# EAGLE design Kicker (EAGLE 6.4)
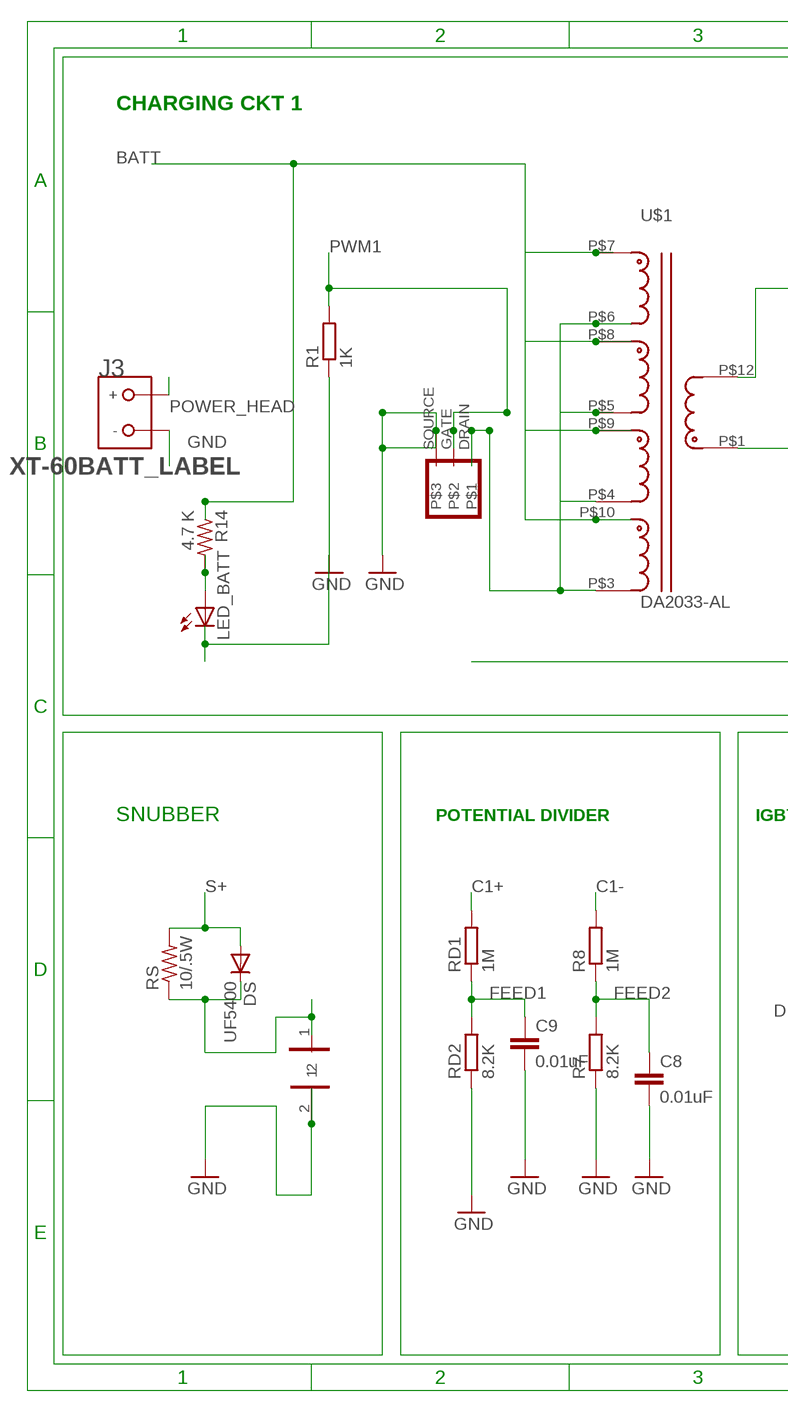
[diagram p0: schematic, sheet 1, part 1 of 2]
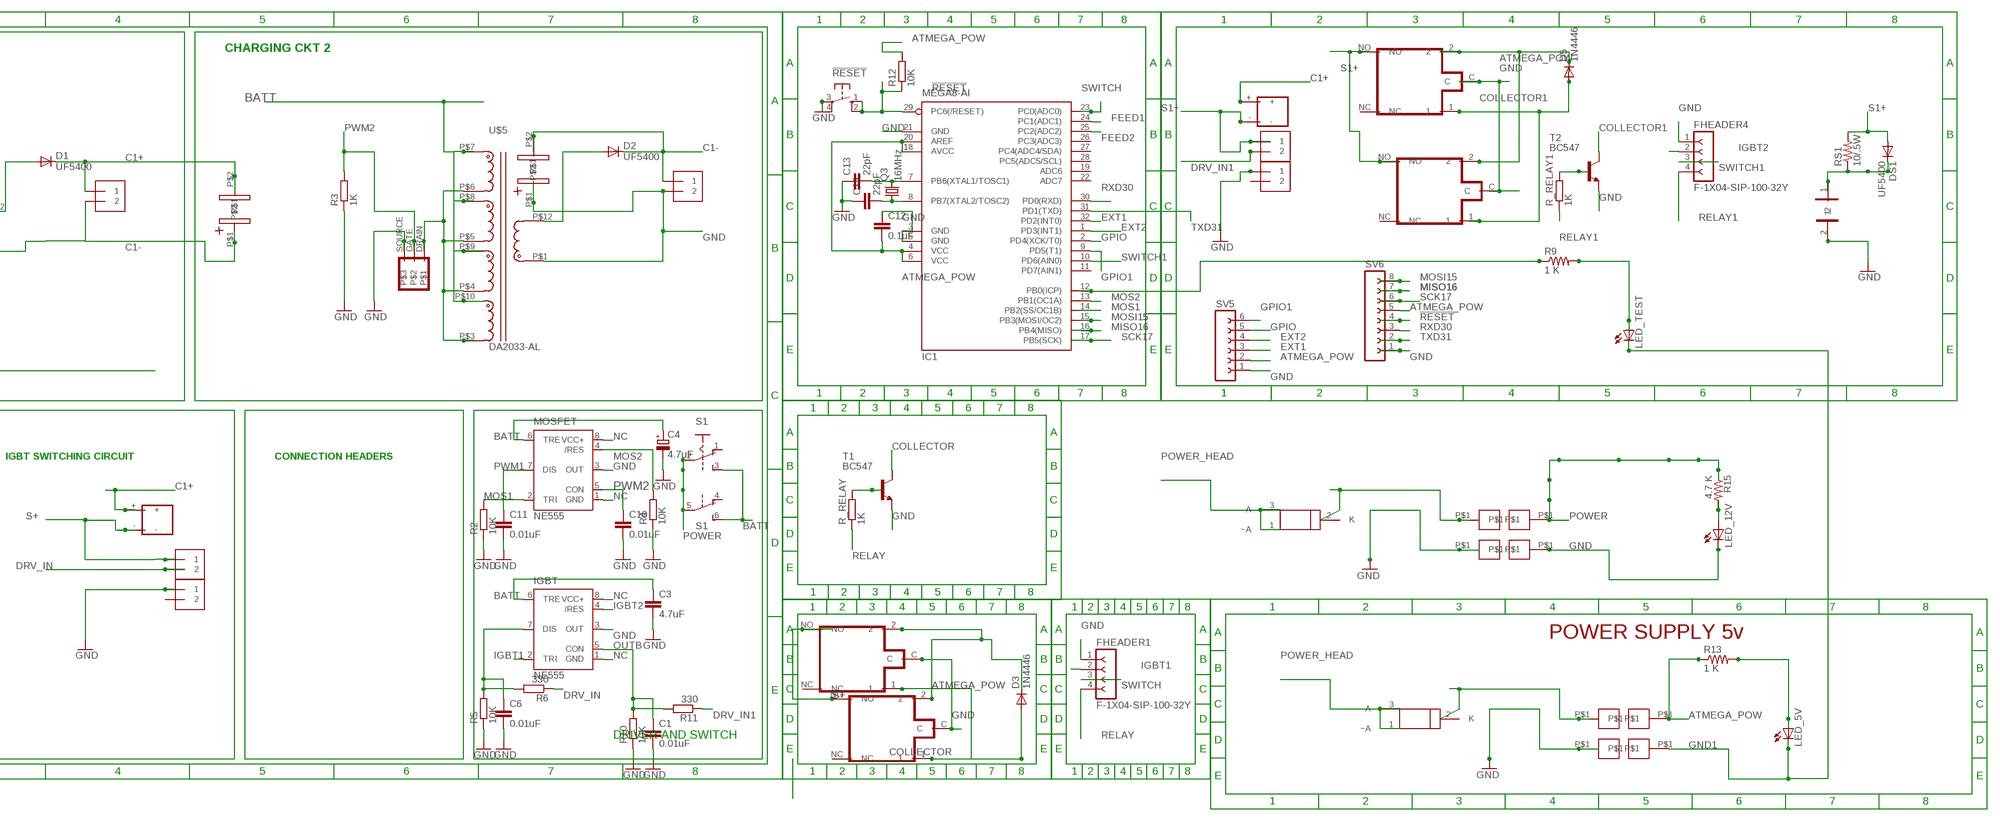
[diagram p1: schematic, sheet 1, part 2 of 2]

## Parts
5V  PINHEAD_1  [PINHEAD_1]
!RESET  10-XX  [B3F-10XX]
C1  0.01uF  C-EUC1206  [C1206]
C3  4.7uF  C-EUC1206  [C1206]
C4  4.7uF  CPOL-EUE2.5-6  [E2,5-6]
C6  0.01uF  C-EUC1206  [C1206]
C8  0.01uF  C-EUC1206  [C1206]
C9  0.01uF  C-EUC1206  [C1206]
C10  0.01uF  C-EUC1206  [C1206]
C11  0.01uF  C-EUC1206  [C1206]
C12  0.1uF  C-EUC1206  [C1206]
C13  22pF  C-EUC1206  [C1206]
C14  22pF  C-EUC1206  [C1206]
D1  UF5400  [DO201-15]
D2  UF5400  [DO201-15]
D3  1N4446  [DO35-10]
D5  1N4446  [DO35-10]
DS  UF5400  [DO201-15]
DS1  UF5400  [DO201-15]
FHEADER1  F-1X04-SIP-100-32Y  [SIP-100-04-32Y]
FHEADER4  F-1X04-SIP-100-32Y  [SIP-100-04-32Y]
GND  PINHEAD_1  [PINHEAD_1]
GND12  PINHEAD_1  [PINHEAD_1]
GND_5V  PINHEAD_1  [PINHEAD_1]
GND_12V1  PINHEAD_1  [PINHEAD_1]
IC1  MEGA8-AI  [TQFP32-08]
IGBT  NE555  [DIL-08]
J1  1X2-3.5MM  [1X2-3.5MM]
J2  1X2-3.5MM  [1X2-3.5MM]
J3  XT-60BATT_LABEL  [XT-60]
J4  1X2-3.5MM  [1X2-3.5MM]
J5  1X2-3.5MM  [1X2-3.5MM]
J6  1X2-3.5MM  [1X2-3.5MM]
J7  1X2-3.5MM  [1X2-3.5MM]
LED_5V  LEDSML1206  [SML1206]
LED_12V  LEDSML1206  [SML1206]
LED_BATT  LEDSML1206  [SML1206]
LED_TEST  LEDSML1206  [SML1206]
MOSFET  NE555  [DIL-08]
POWER_1  PINHEAD_1  [PINHEAD_1]
POWER_HEAD1  PINHEAD_1  [PINHEAD_1]
Q3  16MHz  CRYSTALHC49U70  [HC49U70]
R1  1K  R-EU_R1206  [R1206]
R2  10K  R-EU_R1206  [R1206]
R3  1K  R-EU_R1206  [R1206]
R4  10K  R-EU_R1206  [R1206]
R5  10K  R-EU_R1206  [R1206]
R6  330  R-EU_R1206  [R1206]
R7  8.2K  R-EU_R1206  [R1206]
R8  1M  R-EU_R1206  [R1206]
R9  1 K  FLIPFLOP-RES  [0805-THM]
R10  10K  R-EU_R1206  [R1206]
R11  330  R-EU_R1206  [R1206]
R12  10K  R-EU_R1206  [R1206]
R13  1 K  FLIPFLOP-RES  [0805-THM]
R14  4.7 K  FLIPFLOP-RES  [0805-THM]
R15  4.7 K  FLIPFLOP-RES  [0805-THM]
R_RELAY  1K  R-EU_R1206  [R1206]
R_RELAY1  1K  R-EU_R1206  [R1206]
RD1  1M  R-EU_R1206  [R1206]
RD2  8.2K  R-EU_R1206  [R1206]
RS  10/.5W  R-US_0411/15  [0411/15]
RS1  10/.5W  R-US_0411/15  [0411/15]
S1  A68-A31  [A68-A31]
SV5  FE06-1  [FE06]
SV6  FE08-1  [FE08]
T1  BC547  [TO92]
T2  BC547  [TO92]
U1  LP38690DT-3.3  [TO228P1042X238-3N]
U4  LP38690DT-3.3  [TO228P1042X238-3N]
U$1  DA2033-AL  [DA2033-AL]
U$2  CAPS  [CAP]
U$3  MOS  [MOS]
U$4  CAPS  [CAP]
U$5  DA2033-AL  [DA2033-AL]
U$6  SCREW  [SCREW]
U$7  POLYCAP  [POLYCAP]
U$8  POLYCAP  [POLYCAP]
U$9  MOS  [MOS]
U$10  REL  [REL]
U$11  REL  [REL]
U$12  REL  [REL]
U$13  REL  [REL]
U$16  SCREW  [SCREW]
V_BAT  PINHEAD_1  [PINHEAD_1]

## Nets
!RESET: !RESET.1(S) !RESET.2(S1) IC1.29(PC6(/RESET)) R12.1 SV6.4
ATMEGA_POW: 5V.P$1 C12.2 D3.C D5.C IC1.4(VCC) IC1.6(VCC) IC1.18(AVCC) IC1.20(AREF) R12.2 R13.1 SV5.2 SV6.5 U$10.2 U$11.2 U$12.2 U$13.2
BATT: C3.1 C4.+ IGBT.6(TRE) MOSFET.6(TRE) R14.1 S1.3(A:S) S1.6(B:S) U$1.P$7 U$1.P$8 U$1.P$9 U$1.P$10 U$5.P$7 U$5.P$8 U$5.P$9 U$5.P$10
C1+: D1.C J2.1 RD1.2 U$2.P$2 U$6.+ U$16.+
C1-: D2.C J1.1 J2.2 R8.2 U$1.P$1 U$2.P$1 U$4.P$2
COLLECTOR: D3.A T1.3(C) U$10.1 U$12.1
COLLECTOR1: D5.A T2.3(C) U$11.1 U$13.1
DRV_IN: J6.2 R6.1
DRV_IN1: J4.2 R11.1
EXT1: IC1.32(PD2(INT0)) SV5.3
EXT2: IC1.1(PD3(INT1)) SV5.4
FEED1: C9.1 IC1.24(PC1(ADC1)) RD1.1 RD2.2
FEED2: C8.1 IC1.25(PC2(ADC2)) R7.2 R8.1
GND: !RESET.3(P) !RESET.4(P1) C1.2 C3.2 C4.- C6.2 C8.2 C9.2 C10.2 C11.2 C12.1 C13.1 C14.1 FHEADER1.1 FHEADER4.1 GND12.P$1 GND_5V.P$1 GND_12V1.P$1 IC1.3(GND) IC1.5(GND) IC1.21(GND) IGBT.3(OUT) J1.2 J3.GND(-) J5.1 J7.1 LED_12V.C LED_BATT.C MOSFET.3(OUT) R1.1 R2.1 R3.1 R4.1 R5.1 R7.1 R10.1 RD2.1 SV5.1 SV6.1 T1.1(E) T2.1(E) U$3.SOURCE U$4.P$1 U$5.P$1 U$7.2 U$8.2 U$9.SOURCE U$10.C U$11.C U$12.C U$13.C
GND1: GND.P$1 LED_5V.C LED_TEST.C
GPIO: IC1.2(PD4(XCK/T0)) SV5.5
GPIO1: IC1.9(PD5(T1)) SV5.6
IGBT1: FHEADER1.2 IGBT.2(TRI)
IGBT2: FHEADER4.2 IGBT.4(/RES)
MISO16: IC1.16(PB4(MISO)) SV6.7
MOS1: IC1.14(PB2(SS/OC1B)) MOSFET.2(TRI) R2.2
MOS2: IC1.13(PB1(OC1A)) MOSFET.4(/RES) R4.2
MOSI15: IC1.15(PB3(MOSI/OC2)) SV6.8
N$1: DS.C RS.1 U$7.1
N$2: R_RELAY.2 T1.2(B)
N$3: C6.1 IGBT.7(DIS) R5.2 R6.2
N$4: D2.A U$5.P$12
N$6: LED_5V.A R13.2
N$7: POWER_HEAD1.P$1 U1.2(K)
N$8: D1.A U$1.P$12
N$9: DS1.C RS1.1 U$8.1
N$11: R_RELAY1.2 T2.2(B)
N$12: LED_BATT.A R14.2
N$14: C13.2 IC1.7(PB6(XTAL1/TOSC1)) Q3.2
N$15: LED_12V.A R15.2
N$16: U4.2(K) V_BAT.P$1
N$17: C14.2 IC1.8(PB7(XTAL2/TOSC2)) Q3.1
N$19: LED_TEST.A R9.2
N$21: U$5.P$3 U$5.P$4 U$5.P$5 U$5.P$6 U$9.DRAIN
N$22: U$1.P$3 U$1.P$4 U$1.P$5 U$1.P$6 U$3.DRAIN
N$23: IC1.12(PB0(ICP)) R9.1
NC: IGBT.1(GND) IGBT.8(VCC+) MOSFET.1(GND) MOSFET.8(VCC+)
OUTB: C1.1 IGBT.5(CON) R10.2 R11.2
POWER: POWER_1.P$1 R15.1 S1.2(A:P) S1.5(B:P)
POWER_HEAD: J3.BATT(+) U1.1(~A) U1.3(A) U4.1(~A) U4.3(A)
PWM1: C11.1 MOSFET.7(DIS) R1.2 U$3.GATE
PWM2: C10.1 MOSFET.5(CON) R3.2 U$9.GATE
RELAY: FHEADER1.4 R_RELAY.1
RELAY1: FHEADER4.4 R_RELAY1.1
RXD30: IC1.30(PD0(RXD)) SV6.3
S1+: DS1.A J4.1 RS1.2 U$6.- U$11.NO U$13.NO
S+: DS.A J6.1 RS.2 U$10.NO U$12.NO U$16.-
SCK17: IC1.17(PB5(SCK)) SV6.6
SWITCH: FHEADER1.3 IC1.23(PC0(ADC0))
SWITCH1: FHEADER4.3 IC1.10(PD6(AIN0))
TXD31: IC1.31(PD1(TXD)) SV6.2
Unconnected: IC1.11(PD7(AIN1)) IC1.19(ADC6) IC1.22(ADC7) IC1.26(PC3(ADC3)) IC1.27(PC4(ADC4/SDA)) IC1.28(PC5(ADC5/SCL)) J5.2 J7.2 S1.1(A:O) S1.4(B:O) U$10.NC U$11.NC U$12.NC U$13.NC

## Notes on the sheet
- CHARGING CKT 2
- CHARGING CKT 1
- SNUBBER | POTENTIAL DIVIDER | IGBT SWITCHING CIRCUIT | CONNECTION HEADERS
- POWER SUPPLY 5v
- DRIVER AND SWITCH

## Library data of the parts
5V GND GND12 GND_5V GND_12V1 POWER_1 POWER_HEAD1 V_BAT = pinhead_1:PINHEAD_1
!RESET = switch-omron:10-XX: OMRON SWITCH; MPN: B3F-1000; OC_FARNELL: 176432; OC_NEWARK: 36M3542
C1 C3 C6 C8-C14 = rcl:C-EU: CAPACITOR, European symbol
C4 = rcl:CPOL-EU: POLARIZED CAPACITOR, European symbol
D1 D2 DS DS1 = diode-1:UF5400: DIODE ultra fast rectifier, 3 A
D3 D5 = diode:1N4446: DIODE high speed (Philips)
FHEADER1 FHEADER4 = con-headers-jp:F-1X04-: FEMALE HEADER
IC1 = atmel:MEGA8: MICROCONTROLLER 8 Kbytes FLASH, 1 kbytes SRAM, 512 bytes EEPROM, USART, 6-channel 10 bit ADC, 2-channel 8 bit ADC Pin compatible with Atmega48, ATMega88, ATMega168 Source: avr.lbr; MPN: ATMEGA8-16AU; OC_FARNELL: 9171371; OC_NEWARK: 73M8863
IGBT MOSFET = st-microelectronics:NE555: General purpose bipolar Timer; MF: Arrow Electronics; MPN: NE555N; OC_FARNELL: 1467742; OC_NEWARK: 89K1486
J1 J2 J4-J7 = adafruit:1X2: 3.5mm Terminal block http://www.ladyada.net/library/pcb/eaglelibrary.html
J3 = RoboJackets-Connectors:XT-60: XT-60 Power Connector Distributor: HobbyKing <http://www.hobbyking.com/hobbyking/store/RC_PRODUCT_SEARCH.asp?strSearch=xt-60>
LED_5V LED_12V LED_BATT LED_TEST = led:LED: LED OSRAM: - CHIPLED LG R971, LG N971, LY N971, LG Q971, LY Q971, LO R971, LY R971 LH N974, LH R974 LS Q976, LO Q976, LY Q976 LO Q996 - Hyper CHIPLED LW Q18S LB Q993, LB Q99A, LB R99A - SideLED LS A670, LO A670, LY A670, LG A670, LP A670 LB A673, LV A673, LT A673, LW A673 LH A674 LY A675 LS A676, LA A676, LO A676, LY A676, LW A676 LS A679, LY A679, LG A679 - Hyper Micro SIDELED® LS Y876, LA Y876, LO Y876, LY Y876 LT Y87S - SmartLED LW L88C, LW L88S LB L89C, LB L89S, LG L890 LS L89K, LO L89K, LY L89K LS L896, LA L896, LO L896, LY L896 - TOPLED LS T670, LO T670, LY T670, LG T670, LP T670 LSG T670, LSP T670, LSY T670, LOP T670, LYG T670 LG T671, LOG T671, LSG T671 LB T673, LV T673, LT T673, LW T673 LH T674 LS T676, LA T676, LO T676, LY T676, LB T676, LH T676, LSB T676, LW T676 LB T67C, LV T67C, LT T67C, LS T67K, LO T67K, LY T67K, LW E67C LS E67B, LA E67B, LO E67B, LY E67B, LB E67C, LV E67C, LT E67C LW T67C LS T679, LY T679, LG T679 LS T770, LO T770, LY T770, LG T770, LP T770 LB T773, LV T773, LT T773, LW T773 LH T774 LS E675, LA E675, LY E675, LS T675 LS T776, LA T776, LO T776, LY T776, LB T776 LHGB T686 LT T68C, LB T68C - Hyper Mini TOPLED® LB M676 - Mini TOPLED Santana® LG M470 LS M47K, LO M47K, LY M47K Source: http://www.osram.convergy.de LUXEON: - LUMILED® LXK2-PW12-R00, LXK2-PW12-S00, LXK2-PW14-U00, LXK2-PW14-V00 LXK2-PM12-R00, LXK2-PM12-S00, LXK2-PM14-U00 LXK2-PE12-Q00, LXK2-PE12-R00, LXK2-PE12-S00, LXK2-PE14-T00, LXK2-PE14-U00 LXK2-PB12-K00, LXK2-PB12-L00, LXK2-PB12-M00, LXK2-PB14-N00, LXK2-PB14-P00, LXK2-PB14-Q00 LXK2-PR12-L00, LXK2-PR12-M00, LXK2-PR14-Q00, LXK2-PR14-R00 LXK2-PD12-Q00, LXK2-PD12-R00, LXK2-PD12-S00 LXK2-PH12-R00, LXK2-PH12-S00 LXK2-PL12-P00, LXK2-PL12-Q00, LXK2-PL12-R00 Source: www.luxeon.com KINGBRIGHT: KA-3528ASYC Source: www.kingbright.com
Q3 = crystal:CRYSTAL: CRYSTAL; OC_FARNELL: unknown; OC_NEWARK: unknown
R1-R8 R10-R12 R_RELAY R_RELAY1 RD1 RD2 = resistor:R-EU_: RESISTOR, European symbol
R9 R13-R15 = adafruit:FLIPFLOP-RES: Flip Flop resistor An 0805 resistor inside a standard 1/4W 5% resistor. Makes for easy mods
RS RS1 = rcl:R-US_: RESISTOR, American symbol
S1 = switch:A68-A31: SLIDING SWITCH Siemens, distributor Buerklin, 11G766
SV5 = con-lsta:FE06-1: FEMALE HEADER; OC_FARNELL: unknown; OC_NEWARK: unknown
SV6 = con-lsta:FE08-1: FEMALE HEADER; OC_FARNELL: unknown; OC_NEWARK: unknown
T1 T2 = transistor:BC547: NPN TRANSISTOR
U1 U4 = LP38690DT-3.3:LP38690DT-3.3; MPN: LP38690DT-3.3; OC_FARNELL: 1008048; OC_NEWARK: 41K7439; PACKAGE: TO-252; SUPPLIER: National Semiconductor
U$1 U$5 = inductor-coilcraft-2:DA2033-AL: Flyback Transformer for Linear Technology LT3750 Reference: http://www.coilcraft.com/da2032.cfm L - 10 uH TurnsRatio Pri:Sec - 1:10 Ipeak - 5.0 A Interwinding capacitance - 76 pF DCRmax: Pri - 0.015, Sec - 1.10 Ohms
U$2 U$4 = Electrolytic-Cap:CAPS
U$3 U$9 = mosfet:MOS
U$6 U$16 = screw:SCREW
U$7 U$8 = polycap:POLYCAP
U$10-U$13 = rel:REL

## Board
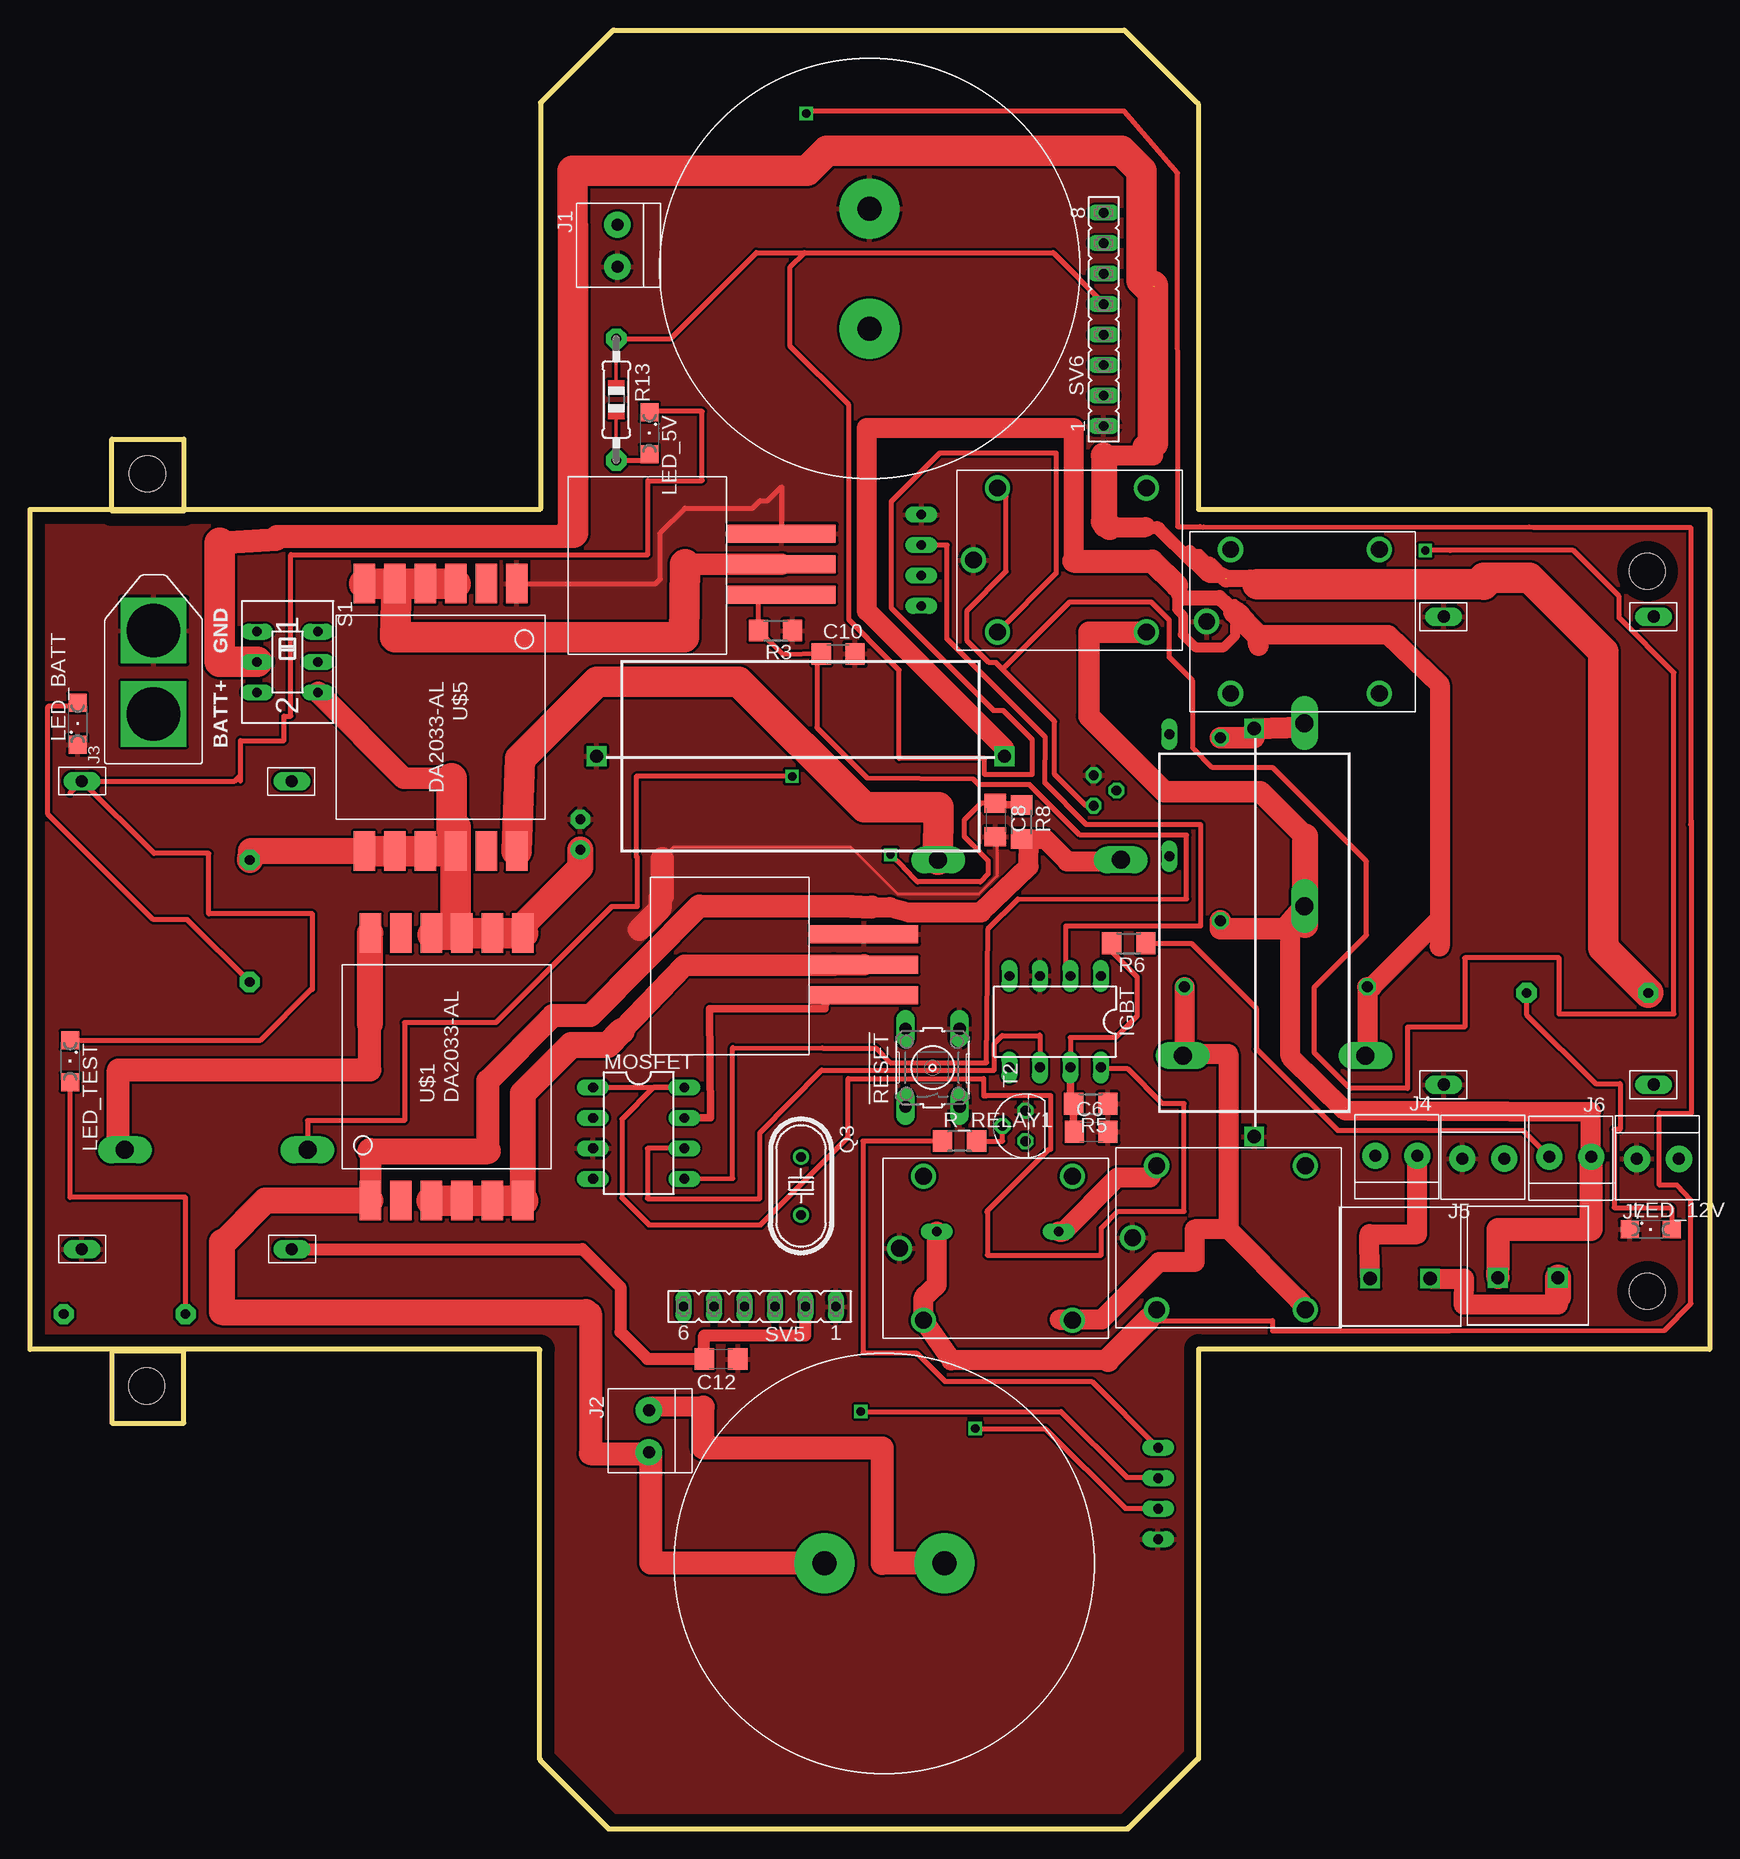
[diagram p2: board, top side]
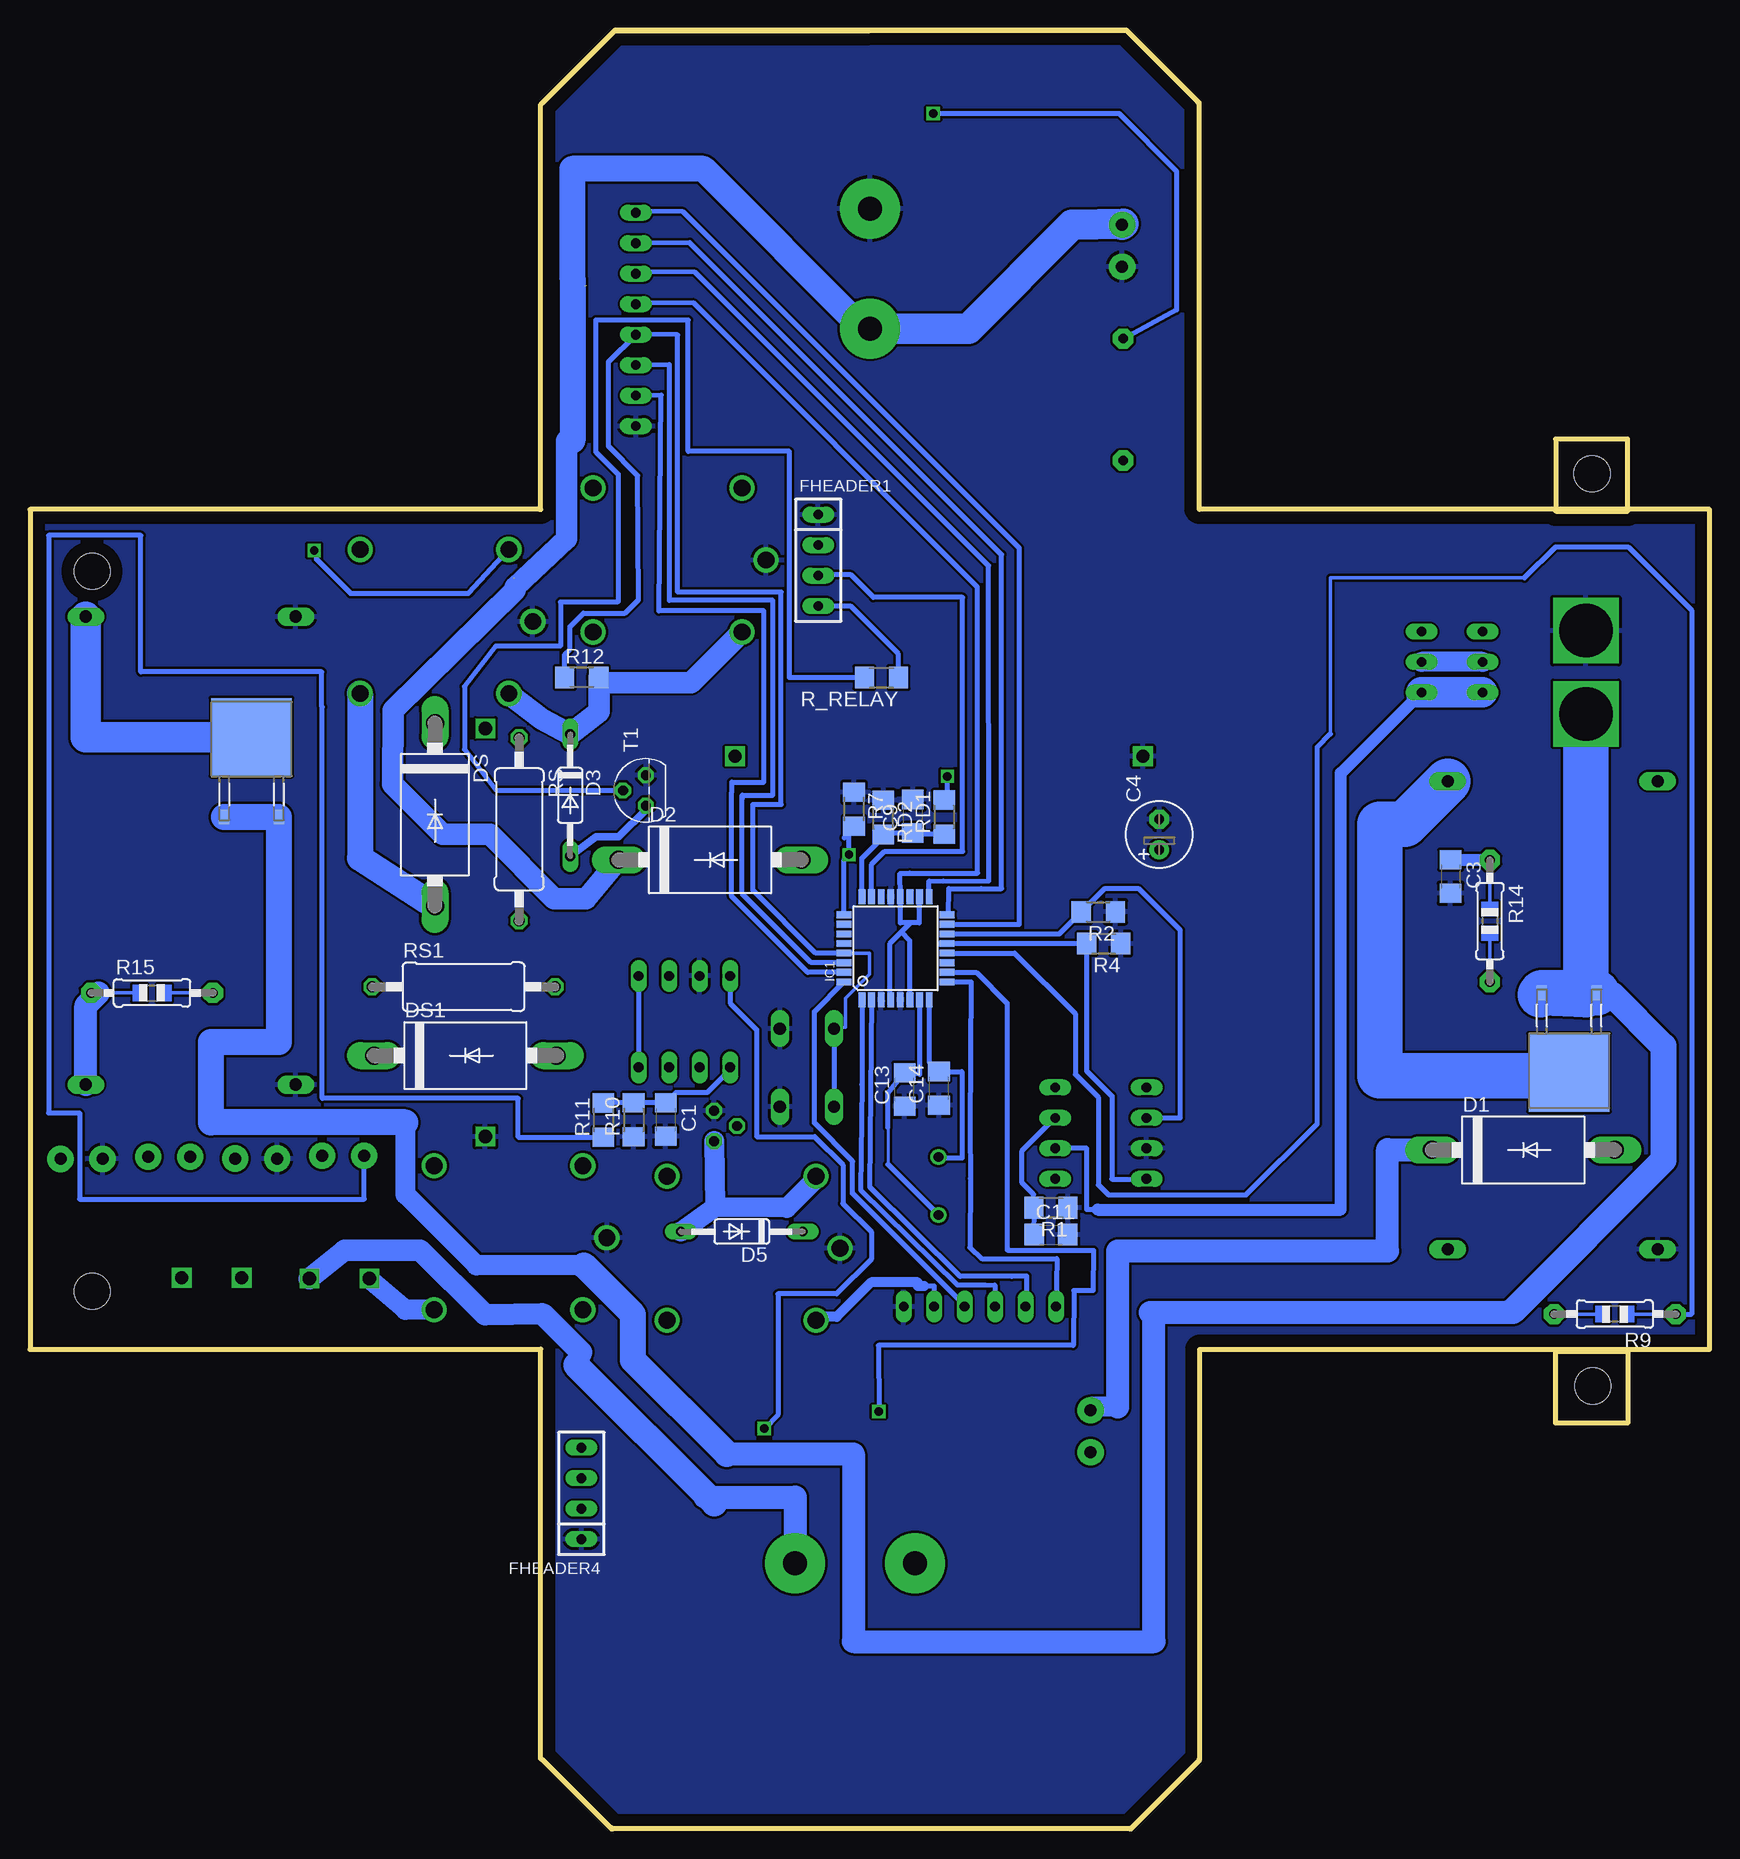
[diagram p3: board, bottom side, seen from below]

Size 140 x 149.9 mm. Coordinates in mm from the lower left corner, seen from the top.
Outline: 42.5,109.95 0,109.95 0,39.95 42.5,39.95
Outline: 97.5,109.95 140,109.95 140,39.95 97.5,39.95
Outline: 6.82,39.8 6.82,33.8 12.82,33.8 12.82,39.8 6.82,39.8
Outline: 6.82,39.8 6.82,39.9
Outline: 42.62,143.8 42.62,143.9 48.62,149.9
Outline: 97.32,143.8 91.22,149.9
Outline: 97.32,5.8 91.52,0
Outline: 42.52,5.8 42.52,5.7 48.22,0
Outline: 48.32,0 91.42,0 91.52,0.1
Outline: 97.42,5.8 97.42,40
Outline: 42.49,5.76 42.49,39.85 42.47,39.87 42.47,39.87 42.49,39.86
Outline: 42.55,143.84 42.55,110 42.51,109.97
Outline: 97.43,109.94 97.43,143.69 97.15,143.98
Outline: 6.82,109.8 6.82,115.8 12.82,115.8 12.82,109.8 6.82,109.8
Copper layers (1*16): Top 0.09mm / dielectric 1.5mm / Bottom 0.09mm
Design rules "default *": minimum track width 10mil, minimum drill 24mil, track to track 8mil, track to pad 8mil, pad to pad 8mil, via to via 8mil, smd to smd 8mil, copper to edge 40mil, drill to drill 8mil, minimum pad ring 10mil, minimum via ring 8mil, stop-mask expansion 4mil, vias tented up to drill 0mil, thermal gap 10mil
Holes 3 mm at 134.82,44.8 9.72,36.9 9.8,112.92 134.82,104.8

### Footprints (pad centres in the part's own frame; a part is rotated, then mirrored left to right if it is on the bottom)
PINHEAD_1 = drill 1.016 long: P$1 0,0
B3F-10XX = drill 1.016 long: 1 -3.251,2.261; 2 3.251,2.261; 3 -3.251,-2.261; 4 3.251,-2.261
C1206 = smd 1.6 x 1.8: 1 -1.4,0; 2 1.4,0
E2,5-6 = drill 0.813 pad 1.6: + -1.27,0 | drill 0.813 pad 1.6 octagon: - 1.27,0
DO201-15 = drill 1.499 long: A 7.62,0; C -7.62,0
DO35-10 = drill 0.813 long: A 5.08,0; C -5.08,0
SIP-100-04-32Y = drill 0.813 long: 1 -3.81,0; 2 -1.27,0; 3 1.27,0; 4 3.81,0
TQFP32-08 = smd 1.27 x 0.559: 1 -4.293,2.8; 2 -4.293,2; 3 -4.293,1.2; 4 -4.293,0.4; 5 -4.293,-0.4; 6 -4.293,-1.2; 7 -4.293,-2; 8 -4.293,-2.8; 17 4.293,-2.8; 18 4.293,-2; 19 4.293,-1.2; 20 4.293,-0.4; 21 4.293,0.4; 22 4.293,1.2; 23 4.293,2; 24 4.293,2.8 | smd 0.559 x 1.27: 9 -2.8,-4.293; 10 -2,-4.293; 11 -1.2,-4.293; 12 -0.4,-4.293; 13 0.4,-4.293; 14 1.2,-4.293; 15 2,-4.293; 16 2.8,-4.293; 25 2.8,4.293; 26 2,4.293; 27 1.2,4.293; 28 0.4,4.293; 29 -0.4,4.293; 30 -1.2,4.293; 31 -2,4.293; 32 -2.8,4.293
DIL-08 = drill 0.813 long: 1 -3.81,-3.81; 2 -1.27,-3.81; 3 1.27,-3.81; 4 3.81,-3.81; 5 3.81,3.81; 6 1.27,3.81; 7 -1.27,3.81; 8 -3.81,3.81
1X2-3.5MM = drill 1 pad 2.184: 1 1.8,0; 2 -1.7,0
XT-60 = drill 4.446 square: BATT 0,4.154; GND 0,11.092
SML1206 = smd 1.5 x 1.5: A 1.75,0; C -1.75,0
HC49U70 = drill 0.813: 1 -2.413,0; 2 2.413,0
R1206 = smd 1.6 x 1.803: 1 -1.422,0; 2 1.422,0
0805-THM = drill 0.813 pad 1.676 octagon: 1 -5.08,0; 2 5.08,0
0411/15 = drill 0.914 octagon: 1 -7.62,0; 2 7.62,0
A68-A31 = drill 0.813 long: 1 -2.54,-2.54; 2 0,-2.54; 3 2.54,-2.54; 4 -2.54,2.54; 5 0,2.54; 6 2.54,2.54
FE06 = drill 0.813 long: 1 -6.35,0; 2 -3.81,0; 3 -1.27,0; 4 1.27,0; 5 3.81,0; 6 6.35,0
FE08 = drill 0.813 long: 1 -8.89,0; 2 -6.35,0; 3 -3.81,0; 4 -1.27,0; 5 1.27,0; 6 3.81,0; 7 6.35,0; 8 8.89,0
TO92 = drill 0.813 octagon: 1 1.27,0; 2 0,1.905; 3 -1.27,0
TO228P1042X238-3N = smd 0.889 x 1.219: 1 -2.286,-6.502; 3 2.286,-6.502 | smd 6.731 x 6.502: 2 0,0.152
DA2033-AL = smd 3.3 x 1.79: P$1 -11.15,6.35; P$2 -11.15,3.81; P$3 -11.15,1.27; P$4 -11.15,-1.27; P$5 -11.15,-3.81; P$6 -11.15,-6.35; P$7 11.15,-6.35; P$8 11.15,-3.81; P$9 11.15,-1.27; P$10 11.15,1.27; P$11 11.15,3.81; P$12 11.15,6.35
CAP = drill 2 pad 5: P$1 -5,0; P$2 5,0
MOS = smd 9 x 1.5: DRAIN 1,0.1; GATE 1,-2.44; SOURCE 1,2.64
SCREW = drill 1.1 square: + -2.5,0; - 2.5,0
POLYCAP = drill 1.1 square: 1 -17,0; 2 17,0
REL = drill 1.4: 1 6.2,-6.4; 2 6.2,5.6; C 8.2,-0.4; NC -6.2,-6.4; NO -6.2,5.6

### Placement (x,y rotation side)
5V  21.82,48.3 270 top
!RESET  75.24,63.43 90 top
C1  87.02,59.1 270 bottom
C3  21.59,79.36 270 bottom
C4  45.87,82.86 90 bottom
C6  88.47,58.09 0 top
C8  80.47,84.07 270 top
C9  66.41,84.38 90 bottom
C10  67.36,97.9 0 top
C11  54.9,49.51 0 bottom
C12  57.6,39.14 180 top
C13  67.1,61.61 90 bottom
C14  64.23,61.7 90 bottom
D1  15.52,56.57 0 bottom
D2  83.32,80.74 0 bottom
D3  94.97,86.13 270 bottom
D5  80.66,49.77 180 bottom
DS  106.25,84.52 270 bottom
DS1  103.71,64.43 0 bottom
FHEADER1  74.3,105.71 270 bottom
FHEADER4  94.04,27.95 90 bottom
GND  4.32,87.3 270 top
GND12  117.85,101.02 90 top
GND_5V  4.32,48.3 270 top
GND_12V1  117.85,62.02 90 top
IC1  67.85,73.37 90 bottom
IGBT  85.45,67.26 180 top
J1  48.96,131.88 90 top
J2  51.59,33.07 90 top
J3  10.3,88.76 0 top
J4  113.84,56.09 0 top
J5  121.2,55.86 180 top
J6  128.34,56 0 top
J7  135.75,55.82 180 top
LED_5V  51.64,116.31 270 top
LED_12V  135.09,49.95 0 top
LED_BATT  3.98,92.1 90 top
LED_TEST  3.35,63.98 270 top
MOSFET  50.74,57.97 270 top
POWER_1  135.35,62.02 90 top
POWER_HEAD1  135.35,101.02 90 top
Q3  64.27,53.57 270 top
R1  54.89,51.76 180 bottom
R2  50.95,76.41 180 bottom
R3  62.15,99.85 180 top
R4  50.5,73.77 180 bottom
R5  88.42,60.42 180 top
R6  91.59,73.79 180 top
R7  71.31,84.96 270 bottom
R8  82.65,83.9 270 top
R9  7.89,42.89 180 bottom
R10  89.69,59.08 90 bottom
R11  92.2,59.06 90 bottom
R12  94,95.95 0 bottom
R13  48.87,119.11 270 top
R14  18.31,75.65 270 bottom
R15  129.83,69.66 0 bottom
R_RELAY  69.03,95.94 180 bottom
R_RELAY1  77.49,57.31 0 top
RD1  63.81,84.31 90 bottom
RD2  68.87,84.28 270 bottom
RS  99.23,83.29 270 bottom
RS1  103.85,70.17 0 bottom
S1  21.46,97.23 270 top
SV5  60.83,43.52 180 top
SV6  89.5,125.78 90 top
T1  88.66,86.53 90 bottom
T2  82.97,58.57 90 top
U1  121.54,90.81 0 bottom
U4  11.7,63.17 180 bottom
U$1  34.74,63.49 90 top
U$2  71.21,22.12 0 top
U$3  68.54,71.89 0 top
U$4  69.98,130.02 270 top
U$5  34.22,92.62 270 top
U$6  114.21,45.85 180 top
U$7  102.04,74.69 270 top
U$8  64.22,89.38 180 top
U$9  61.66,105.28 0 top
U$10  86.85,105.33 180 top
U$11  80.69,47.97 180 top
U$12  106.29,100.2 180 top
U$13  100.11,48.85 180 top
U$16  124.86,45.93 180 top
V_BAT  21.82,87.3 90 top

### Tracks (layer width: path | path; a pad name or v marks a point on that pad's centre or on a via)
!RESET
  Bottom 0.305: IC1.29 70.01,72.97 70.01,71.2 72.02,69.19 72.02,66.8 !RESET.2
  Bottom 0.406: !RESET.2 !RESET.1 | IC1.29 74.51,72.97 79.75,78.22 79.75,85.37 77.38,85.37 77.38,103.05 86.01,103.05 86.01,124.5 89.21,124.55 SV6.4 91.77,122.24 91.77,115.21 89.34,112.77 89.28,102.42 90.4,101.3 93.87,101.3 94.99,100.18 94.99,98.31 95.43,97.88 R12.1
ATMEGA_POW  (via drill 0.7)
  Top 0.406: 53.16,39.1 56.2,39.1 C12.2 56.44,39.14 | 64.55,131.35 60.55,131.35 53.39,124.19 53.39,124.16 48.92,124.16 48.92,123.5 48.83,124.24 48.91,123.4 R13.1 | 64.55,131.35 85.31,131.35 89.55,127.06 89.77,127.11 SV6.5 | 64.55,131.35 63.37,130.17 63.37,123.54 68.26,118.66 68.26,100.77 69.87,99.16 69.87,99.14 72.44,96.57 72.44,89.2 79.57,89.2 79.57,87.86 83.54,87.86 83.54,90.78 81.11,93.21 80.31,93.21 71.78,101.74 71.78,110.59 75.83,114.65 85.53,114.65 85.53,104.61 U$10.2 | 93.18,42.35 103.57,42.35 103.57,41.5 118.35,41.5 118.35,41.49 136.27,41.53 138.44,43.75 138.45,52.41 137.31,53.63 135.82,53.63 135.82,59.64 138.51,59.64 138.51,83.62 | 138.51,83.62 138.51,83.96 | v64.72,142.94 64.9,143.13 91.22,143.13 95.66,137.99 95.67,108.51 97.52,108.51 97.82,108.47 124.96,108.49 125.32,108.45 138.44,108.45 138.44,83.7 138.51,83.62
  Top 1.016: 5V.P$1 46.06,48.3 49.22,45.15 49.22,41.41 51.47,39.15 56.19,39.15 C12.2 | 56.44,39.14 C12.2 56.2,41.12 64.64,41.12 SV5.2
  Top 1.676: D5.C 75.59,48.63 75.59,45.33 74.49,44.28 U$11.2 76.8,39.04 89.86,39.04 | U$13.2 93.18,42.35
  Top 1.93: 89.86,39.04 89.86,39.1 93.15,42.39 | 93.15,42.39 93.26,42.5 | 93.18,42.35 93.18,42.36 93.15,42.39
  Bottom 0.406: IC1.18 65.89,77.67 65.89,75.5 66.6,75.5 | 66.6,75.5 67.45,75.5 IC1.20 67.47,79.63 66.69,79.63 61,79.63 61.02,103.48 84.7,127.15 89.15,127.12 SV6.5 | IC1.4 68.31,69.08 68.31,73.79 67.37,74.74 | 67.37,74.74 66.6,75.5 | IC1.6 66.65,74.02 67.37,74.74 | 73.57,42.59 74.26,42.59 U$11.2 | v64.72,142.94 49.22,142.94 44.42,138.12 44.42,126.57 R13.1 | SV5.2 64.61,43.52 64.61,45.22 65.46,45.22
  Bottom 0.813: 65.46,45.22 65.98,45.22 65.98,45.52 69.89,45.52 72.75,42.67 74.19,42.67 U$11.2
  Bottom 1.778: U$10.2 80.69,99.73 84.91,95.51 92.14,95.51 R12.2 92.58,93.07 D3.C 97.33,92.45 U$12.2
BATT
  Top 0.406: MOSFET.6 51.47,56.7 51.47,52.52 60.85,52.52 60.85,58 65.98,63.22 77.14,63.22 80.39,63.23 80.39,65.46 81.04,66.1 84.16,66.1 84.18,66.08 | 84.18,66.17 84.18,66.08 | 84.18,66.08 IGBT.6
  Top 1.778: U$1.P$10 33.55,74.64 33.55,74.49 | 35.16,87.54 31.15,87.54 S1.6
  Top 2.184: U$5.P$7 18.42,81.47 R14.1 | C4.+ 45.87,80.1 40.41,74.64
  Top 2.54: 33.55,74.49 35.48,74.49 | 35.48,74.49 36.01,74.49 U$1.P$9 U$1.P$8 40.41,74.64 U$1.P$7 | U$5.P$7 U$5.P$8 U$5.P$9 U$5.P$10 | U$5.P$10 35.48,83.51 35.48,74.49 | U$5.P$10 35.16,83.51 35.16,87.54
  Bottom 0.406: 51,51.59 51.9,51.59 51.9,56.7 MOSFET.6
  Bottom 1.016: 51,51.59 30.73,51.59 30.73,87.97 24.41,94.29 S1.6 | R14.1 21.55,80.73 C3.1
  Bottom 1.676: 24.41,94.69 24.41,94.29
  Bottom 2.54: S1.3 S1.6
C1+  (via drill 0.7)
  Top 0.406: v63.53,87.71 50.53,87.71 50.53,80.99 50.62,80.99 50.62,76.85 48.48,76.85 38.82,67.19 31.21,67.19 31.21,59.02 23.14,59.02 D1.C
  Top 1.676: U$6.+ 119.53,45.85 119.49,43.7 127.36,43.7 U$16.+ | 56.11,35.16 51.59,35.16 J2.1
  Top 1.93: U$2.P$2 71.06,22.12 71.06,31.72 56.11,31.72 56.11,35.16
  Top 2.184: U$16.+ 127.36,44.37
  Bottom 0.406: 83.3,27.45 83.52,27.45 83.52,26.98 83.74,26.98 83.74,27.65 | RD1.2 63.53,85.73 v63.53,87.71
  Bottom 1.676: 49.33,35.16 51.59,35.16 J2.1
  Bottom 1.778: 94.46,38.64 94.07,39.68 97.32,42.92 | 97.32,42.92 102.05,42.82 107.46,48.23 113.75,48.23 U$6.+ | 97.32,42.92 97.19,42.9 94.02,39.72 94.54,38.68 83.3,27.45
  Bottom 1.93: 83.74,27.65 76.21,27.65 U$2.P$2 | 49.33,35.16 49.33,48.16 26.85,48.16 26.85,56.6 23.14,56.6 D1.C
  Bottom 2.184: 82.94,27.12 94.46,38.64
C1-
  Top 1.676: 70.17,76.81 71.68,76.81 73.26,76.37 79.27,76.37 83.24,80.19 83.27,82.41 R8.2 84.59,82.49 86.46,80.62 90.81,80.62 D2.C
  Top 1.778: U$1.P$1 28.39,56.47
  Top 1.93: 38.18,56.47 38.18,62.35 43.6,67.78 46.71,67.78 55.79,76.9 68.49,76.86 70.17,76.81 | 46.35,42.96 46.73,42.96 46.73,31.26 51.59,31.26 | 51.59,31.26 J2.2 | 51.59,31.26 51.74,31.26 51.74,22.16 66.21,22.16 U$2.P$1
  Top 2.184: U$1.P$1 19.61,52.34 16.17,48.9 15.98,48.9 15.98,43.05 46.35,43.05 46.35,42.96 | 28.39,56.47 38.18,56.47
  Bottom 1.778: 94.79,115.69 95.28,115.69 95.28,107.5 99.55,103.46 99.55,103.22 109.73,93.2 109.79,87.05 105.6,82.86 101.67,82.86 96.31,77.51 93.63,77.51 D2.C
  Bottom 2.184: U$4.P$2 70.55,125.02 83.86,138.33 94.81,138.33 94.81,129.27 94.79,129.27 94.79,115.69
  Bottom 2.54: U$4.P$2 61.79,125.02 53.13,133.69 48.86,133.74 J1.1
COLLECTOR  (via drill 0.7)
  Top 0.406: T1.3 88.02,85.26 85.4,87.87 85.4,92.29 81.07,96.63 | 81.07,96.63 80.52,97.17 79.94,97.17 78.11,99 78.11,101.52 81.36,104.78 81.36,111.02 U$10.1 | 81.07,96.63 86.67,102.22 93.47,102.22 94.96,100.73 94.96,97.63 96.92,95.67 96.92,90.09 98.58,88.43 103.6,88.43 111.41,80.62 111.41,74.48 107.05,70.11 107.05,64.69 110.03,61.7 114.82,61.7 114.82,66.8 119.6,66.8 119.6,72.58 127.46,72.58 127.46,67.89 137.03,67.89 137.03,96.35 132.47,100.91 132.47,102.7 128.64,106.54 118.39,106.54 v116.31,106.53
  Bottom 0.406: v116.31,106.53 116.11,105.79 113.28,102.96 103.45,102.96 U$12.1
  Bottom 0.61: T1.3 88.66,84.94 90.93,82.67 92.82,82.67 D3.A
COLLECTOR1
  Top 1.676: D5.A 86.13,49.77 90.66,54.3 93.35,54.3 U$13.1
  Bottom 1.676: T2.3 82.92,51.78 | 82.92,51.78 D5.A | U$11.1 74.65,53.99 76.9,51.74 82.85,51.79 82.92,51.78
DRV_IN
  Top 0.406: R6.1 96.82,73.79 102.21,68.39 102.21,64.99 109.01,58.19 124.45,58.19 J6.2
DRV_IN1
  Bottom 0.406: R11.1 99.3,57.64 99.3,60.88 115.64,60.88 115.64,93.5 115.68,93.5 115.68,96.41 130.76,96.41 130.76,107.77 138.46,107.77 138.46,59.67 135.86,59.67 135.86,52.46 112.14,52.46 J4.2
EXT1
  Bottom 0.406: SV5.3 62.11,43.63 71.44,52.95 71.42,55.63 74.62,58.82 74.62,68.1 IC1.32
EXT2
  Bottom 0.406: IC1.1 70.65,62.01 70.64,62.01 70.75,53.25 62.7,45.32 60.37,45.33 59.57,45.31 59.51,43.57 SV5.4 | 59.9,43.87 SV5.4 | 59.89,43.86 SV5.4
FEED1
  Bottom 0.406: IC1.24 70.65,80.88 68.87,82.66 RD2.2 68.74,82.98 C9.1 66.31,82.89 RD1.1
FEED2  (via drill 0.7)
  Top 0.406: C8.1 79.28,85.47 77.87,84.05 77.87,82.71 78.57,82.01 78.57,81.98 79.86,80.69 79.86,79.57 79.21,78.92 73.99,78.92 72.84,80.07 v71.73,81.18
  Top 0.61: R8.1 80.6,85.34 C8.1
  Bottom 0.406: 72.14,82.56 R7.2 71.73,83.12 v71.73,81.18 72.14,80.77 IC1.25
GND
  Top 0.254: C8.2 80.62,82.67 80.62,79.38 80.57,79.38 79.07,77.88 72.34,77.88 68.43,81.79 53.62,81.79 52.69,80.86
  Top 0.406: U$5.P$1 52.16,103.77 52.53,104.14 52.53,107.99 54.6,110.05 60.25,110.05 60.87,110.67 61.49,110.67 62.65,111.83 62.65,107.94 U$9.SOURCE
  Top 1.93: 52.69,80.86 52.69,77.7 52.51,77.52 52.51,76.67 50.8,74.96
  pour Bottom: 42.56,143.81 42.56,143.84 48.6,149.88 91.25,149.88 97.42,143.71 97.43,143.71 97.43,109.94 140.01,109.94 140.01,39.95 97.43,39.95 97.43,5.87 97.4,5.87 91.56,0.03 48.19,0.03 42.47,5.75 42.49,5.75 42.49,39.93 0,39.93 0,109.99 42.53,109.99 42.53,143.77
  pour Top: 0.15,109.9 42.55,109.9 42.55,143.79 42.55,143.83 48.61,149.89 91.24,149.89 97.41,143.72 97.43,143.72 97.43,109.98 140.01,109.98 140.01,39.95 97.41,39.95 97.41,5.9 97.41,5.9 91.57,0.06 48.17,0.06 42.49,5.74 42.49,39.94 0.04,39.94 0.04,109.88
GND1
  Top 0.406: 3.35,86.33 GND.P$1 | LED_5V.C 51.64,118.11 56.04,118.11 56.04,112.34 51.52,112.34 51.52,106.18 21.74,106.18 21.74,92.72 21.18,92.72 | 17.56,87.3 17.56,87.81 | 17.56,87.81 17.56,90.68 21.18,90.68 21.18,92.72 | 21.18,92.72 21.15,92.72 | LED_TEST.C 19.21,65.73 23.44,69.96 23.55,69.96 23.55,76.24 14.91,76.24 14.91,81.28 10.34,81.28 GND.P$1 | GND.P$1 17.05,87.3 17.56,87.81
GPIO
  Bottom 0.406: IC1.2 70,53.49 62.47,46.03 58.18,46.03 56.91,46.05 56.93,43.52 SV5.5
GPIO1
  Bottom 0.406: IC1.9 61.56,70.57 61.63,58.29 61.61,54.2 61.66,48.45 60.65,47.51 54.41,47.51 SV5.6
IGBT1
  Top 0.406: IGBT.2 86.34,71.07 86.34,75.25 97.6,75.25 97.6,78.93 97.58,78.93 97.58,83.68 88.06,83.68 84.59,87.15 84.64,90.98 76.43,99.18 76.45,106.98 FHEADER1.2
IGBT2  (via drill 0.7)
  Top 0.406: v78.78,33.36 84.64,33.36 91.3,26.7 94.02,26.7 FHEADER4.2
  Bottom 0.406: IGBT.4 81.64,68.8 79.4,66.56 79.43,66.56 79.43,57.68 74.59,57.68 72.23,55.32 72.23,52.1 69.87,49.74 69.87,47.48 72.77,44.58 77.66,44.58 77.66,34.48 v78.78,33.36
MISO16
  Bottom 0.406: IC1.16 63.43,76.17 63.41,78.35 60.69,78.35 60.71,78.36 59.01,78.36 59.01,106.19 85.01,132.18 89.24,132.14 SV6.7
MOS1
  Bottom 0.406: IC1.14 54.2,74.57 R2.2 50.45,78.33 47.55,78.33 44.12,74.9 44.12,59.24 MOSFET.2
MOS2
  Bottom 0.406: IC1.13 63.6,73.73 64.18,73.73 64.14,73.77 R4.2 51.92,63.17 49.88,61.12 49.82,61.12 49.82,54.14 46.93,54.14 MOSFET.4
MOSI15
  Bottom 0.406: IC1.15 57.54,75.38 57.54,106.73 85.55,134.74 89.54,134.8 SV6.8
N$1
  Top 1.778: RS.1 102.03,90.91 U$7.1 106.19,91.78 DS.C
N$2
  Bottom 0.406: R_RELAY.2 76.69,95.94 76.69,103.66 76.69,114.78 85.14,114.78 85.14,125.71 92.85,125.71 92.85,114.72 92.8,114.72 90.98,112.89 90.98,102.29 91.05,102.22 95.77,102.22 95.77,98.56 101.17,98.56 103.78,95.2 103.78,89.95 101.15,86.56 90.61,86.56 T1.2
N$3
  Top 0.406: R6.2 90.17,73.1 92.28,70.99 92.28,67.72 90.49,65.93 86.72,65.93 IGBT.7
  Top 0.61: IGBT.7 86.72,60.09 R5.2 87,58.04 C6.1
N$4
  Top 2.54: U$5.P$12 40.85,89.16 47.29,95.6 59.06,95.6 69.55,85.11 75.75,85.11 D2.A
N$6
  Top 0.406: R13.2 51.11,114.02 LED_5V.A
N$7
  Bottom 2.54: U1.2 135.35,90.96 POWER_HEAD1.P$1
N$8
  Top 1.93: D1.A 7.37,56.57 7.37,63.25 28.33,63.25 28.33,68.23
  Top 2.184: U$1.P$12 28.33,74.64 28.33,68.23 28.33,67.1
N$9
  Top 0.813: 95.61,103.31 95.61,101.64 96.1,101.14 96.1,99.52 97.14,98.48 99.51,98.48 100.46,99.43 100.46,101.91 100.43,102.07
  Top 1.27: 95.56,103.61 95.87,102.59 | 95.87,102.59 99.18,102.59 100.87,101.03 | 95.87,102.59 95.61,103.31
  Top 1.676: U$8.1 81.22,90.04 69.77,101.49 69.77,116.75 86.99,116.75 86.99,105.64 | 117.51,75.82 117.51,95.34 113.2,99.5 102.29,99.54 102.4,98.56 | 117.51,75.82 117.51,73.53 | 117.51,75.82 111.87,70.17 RS1.1 111.47,64.58 DS1.C
  Top 1.93: 86.99,105.64 93.53,105.64 95.56,103.61 | 100.87,101.03 100.43,101.4 102.29,99.54
N$11
  Top 0.406: R_RELAY1.2 81.06,57.31 T2.2
N$12
  Top 0.406: R14.2 13.12,75.77 10.28,75.77 1.49,84.56 1.49,93.46 1.59,93.57 3.31,93.57 3.42,93.68 3.8,93.68 LED_BATT.A
N$14
  Bottom 0.254: 68.49,58.44 68.49,55.38
  Bottom 0.406: IC1.7 65.85,62.88 C13.2 68.49,61.31 68.49,58.44 | Q3.2 68.49,55.38
N$15
  Top 0.406: LED_12V.A 136.84,51.77 132.05,51.77 132.05,58.28 132.56,58.28 132.56,62.09 130.51,62.09 124.75,67.85 R15.2
N$16
  Bottom 3.81: U4.2 11.9,62.83 11.9,62.73 27.5,62.73 27.5,83.72 25.41,83.72 V_BAT.P$1
N$17
  Bottom 0.406: IC1.8 65.05,63.92 C14.2 62.32,63.1 62.29,55.89 64.18,55.89 Q3.1
N$19
  Top 0.406: R9.2 12.97,52.61 3.35,52.61 LED_TEST.A
N$21
  Top 1.778: 54.6,105.38 U$9.DRAIN
  Top 2.54: U$5.P$6 U$5.P$5 U$5.P$4 U$5.P$3 30.57,103.73 30.46,99.28 54.51,99.28 54.6,105.38
N$22
  Top 1.778: 49.32,66.49 54.54,71.96 67,71.97 U$3.DRAIN
  Top 2.184: U$1.P$6 41.09,61.28 45.14,65.33 48.17,65.33 49.32,66.49
  Top 2.54: U$1.P$3 U$1.P$4 U$1.P$5 U$1.P$6
N$23
  Bottom 0.305: 15.43,104.23 31.6,104.23 31.6,91.24
  Bottom 0.406: IC1.12 57.93,72.97 52.87,67.91 52.87,62.88 50.94,60.94 50.94,53.66 50.1,52.82 38.63,52.82 32.7,58.75 32.7,90.14 31.6,91.24 | 15.43,104.23 12.83,106.84 6.79,106.84 1.49,101.54 1.49,42.89 2.78,42.89 2.78,42.85 3.47,42.85 3.47,42.89 R9.1
NC
  Top 0.406: MOSFET.1 MOSFET.8 52,61.78 49.35,59.13 49.35,52.58 51.6,50.33 60.9,50.33 68.2,57.63 68.2,62.52 79.48,62.52 79.48,61.07 79.7,61.07 79.7,61.12 85.07,61.12 85.07,56.61 84.96,56.61 79.75,51.4 79.8,51.4 79.8,47.8 89.31,47.8 89.31,50.06 90.71,51.45 96.21,51.45 96.21,60.42 94.41,60.42 91.51,63.32 89.39,63.32 IGBT.8
  Bottom 0.406: IGBT.1 IGBT.8
OUTB
  Bottom 0.406: IGBT.5 81.64,63.26 83.56,61.35 86.16,61.35 C1.1 R10.2 92.17,60.51 R11.2
POWER  (2 unrouted)
  Top 0.406: S1.5 24.12,97.23
  Top 0.61: 96.67,106.35 97.52,106.35 98.79,105.09 98.86,105.09 99.83,104.11 102.48,104.11 102.63,103.67 | 93.73,114.31 93.73,114.47 93.16,115.03
  Top 1.016: 93.02,108.48 93.94,108.48 96.89,105.53 98.34,105.53 99.65,104.23 | 99.54,104.31 98.76,104.31 97.65,105.43 97.06,105.43 94.11,108.38 89.45,108.38 89.45,114.31 93.73,114.31 | 93.73,128.56 92.65,128.56 | 92.65,138.16 92.65,138.65
  Top 1.27: 96.67,106.35 96.67,106.04 98.23,104.47 99.41,104.47 99.65,104.23
  Top 1.422: 99.65,104.23 101.71,104.23 102.36,103.57 | 102.3,103.72 101.87,104.16 99.69,104.16 99.54,104.31
  Top 1.676: 92.87,128.6 93.11,128.6 93.61,128.6 | 93.61,114.44 89.51,114.44 | 89.51,108.48 90,108.48 93.02,108.48
  Top 1.93: 121.18,103.67 121.18,104.27 | 134.86,69.7 R15.1 | 15.82,107.17 20.59,107.47 20.59,107.69 45.02,107.69 45.02,108
  Top 2.184: 89.51,114.44 89.51,108.96 90,108.48
  Top 2.54: S1.2 15.82,97.23 15.82,107.17 | 45.02,108 45.29,108 45.29,133.55 45.23,133.55 45.23,138.16 64.77,138.16 66.43,139.83 90.98,139.83 92.65,138.16 92.65,129.06 93.11,128.6 | 93.61,128.6 93.61,115.48 93.16,115.03 | 102.3,103.72 121.13,103.72 121.18,103.67 | 121.18,104.27 124.97,104.27 131.16,98.08 131.16,73.41 R15.1
  Bottom 0.406: 135.35,69.66 R15.1 134.29,69.66
  Bottom 1.676: S1.2 S1.5
  Bottom 1.93: POWER_1.P$1 135.35,68.6 134.29,69.66
POWER_HEAD
  Bottom 1.676: 93.82,46.95 102.78,46.95 108.7,52.88 108.7,58.55 109.01,58.86
  Bottom 1.93: 81.92,31.23 71.37,31.23 71.37,15.6 46.31,15.6 46.31,43.03 | 46.63,43.03 46.31,43.03 | 46.31,43.03 16.41,43.03 16.41,43.14
  Bottom 2.184: U1.1 U1.3 119.25,65.58 124.9,65.58 124.9,58.86 109.01,58.86 108.7,58.86 | 14.12,69.49 10.3,69.49 8.09,69.49 3.84,65.23 3.84,55.72 16.41,43.14 | 81.92,31.23 89.74,39.06 89.74,42.88 93.82,46.95
  Bottom 3.81: U4.1 U4.3 | U4.3 14.12,69.49 14.12,69.51 | U4.3 10.3,69.49 J3.BATT
PWM1
  Top 0.61: MOSFET.7 56.71,59.24 56.66,68.34 66.27,68.34 66.36,69.46 68.09,69.46 U$3.GATE
  Bottom 0.406: C11.1 56.35,49.33 R1.2 56.35,52.87 57.3,53.82 57.3,56.49 MOSFET.7
PWM2
  Top 0.406: MOSFET.5 58.57,54.21 58.57,65.1 66.06,65.05 70.5,65.05 71.7,63.85 79.74,63.85 79.86,74.99 82.34,77.47 96.4,77.5 96.4,82.81 87.53,82.81 83.33,87.01 79.1,87.01 78.61,87.5 69.78,87.58 65.6,91.76 65.6,97.16 C10.1 62.75,97.83 R3.2 60.73,102.88 U$9.GATE 63.46,102.88 63.6,102.74 65.09,102.74 65.53,102.3
RELAY
  Bottom 0.406: R_RELAY.1 67.61,97.92 71.56,101.88 74.27,101.88 FHEADER1.4
RELAY1
  Top 0.406: R_RELAY1.1 69.44,57.31 69.44,39.67 73.88,39.67 76.27,37.28 88.51,37.28 FHEADER4.4
  Bottom 0.406: FHEADER4.4 94.04,31.65 94.19,31.5
RXD30
  Bottom 0.406: IC1.30 74.89,72.17 80.64,77.92 80.64,85.86 80.63,85.86 80.63,86.14 78.06,86.14 78.06,102.36 86.7,102.36 86.7,122.02 89.34,121.97 SV6.3
S1+
  Top 1.676: RS1.2 96.23,64.58 | 96.23,64.58 DS1.A | U$6.- 111.7,46.17 111.66,49.56 115.64,49.56 J4.1 | 96.23,64.58 99.89,64.58 99.89,49.96 | 99.89,49.96 105.66,44.19 106.39,43.37 U$13.NO | 99.89,49.96 97.07,49.96 97.07,47.23 94.11,47.23 89.32,42.44 85.83,42.44 U$11.NO
  Bottom 1.676: U$13.NO 108.7,43.25 U$6.-
S+
  Top 1.676: J6.1 130.11,56 130.11,59.72 109.66,59.85 105.08,64.34 105.08,74.52 104.6,75
  Top 1.778: DS.A 104.6,75 99.23,75 RS.2 | U$10.NO 88.25,99.73 88.25,92.73 94.57,86.41 102.56,86.41 106.27,82.7
  Top 1.93: U$16.- 122.39,47.19 122.39,49.96 130.14,49.96 J6.1
  Top 2.184: 106.27,82.7 106.27,75.31 DS.A
  Bottom 2.184: U$12.NO 112.49,80.91 DS.A
SCK17
  Bottom 0.406: IC1.17 65.05,78.98 63.88,78.98 60.07,78.99 60.09,105.26 84.54,129.71 89.18,129.74 SV6.6
SWITCH
  Bottom 0.406: 74.3,104.42 FHEADER1.3 74.25,104.48 71.54,104.48 69.69,102.63 62.26,102.63 62.26,81.46 68.77,81.46 69.85,80.38 IC1.23
SWITCH1  (via drill 0.7)
  Top 0.406: v69.24,34.77 85.94,34.77 91.42,29.29 93.97,29.29 FHEADER4.3
  Bottom 0.406: IC1.10 61.11,71.38 58.54,68.81 58.55,48.23 58.36,48.23 58.46,48.19 51.35,48.19 51.39,44.85 53,44.85 53.03,40.28 69.27,40.28 v69.24,34.77
TXD31
  Bottom 0.406: IC1.31 75.18,71.38 81.51,77.71 81.51,86.38 81.5,86.38 81.5,87.22 78.83,87.22 78.83,101.48 87.57,101.48 87.39,119.48 89.56,119.44 SV6.2